# EAGLE design TESTPL (EAGLE 9.4.2)
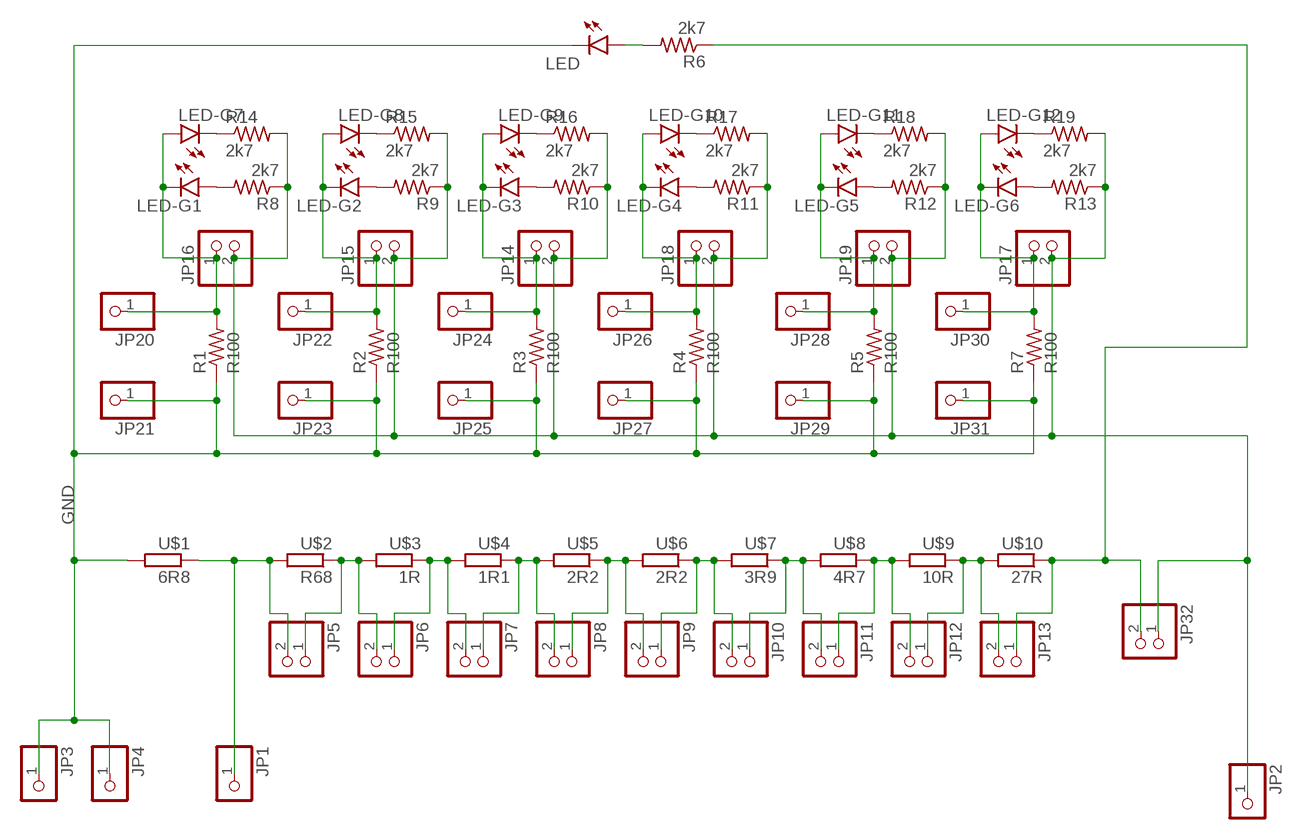
[diagram p0: schematic, sheet 1]

## Parts
JP1  PINHD-1X1  [1X01]
JP2  PINHD-1X1  [1X01]
JP3  PINHD-1X1  [1X01]
JP4  PINHD-1X1  [1X01]
JP5  PINHD-1X2  [1X02]
JP6  PINHD-1X2  [1X02]
JP7  PINHD-1X2  [1X02]
JP8  PINHD-1X2  [1X02]
JP9  PINHD-1X2  [1X02]
JP10  PINHD-1X2  [1X02]
JP11  PINHD-1X2  [1X02]
JP12  PINHD-1X2  [1X02]
JP13  PINHD-1X2  [1X02]
JP14  PINHD-1X2  [1X02]
JP15  PINHD-1X2  [1X02]
JP16  PINHD-1X2  [1X02]
JP17  PINHD-1X2  [1X02]
JP18  PINHD-1X2  [1X02]
JP19  PINHD-1X2  [1X02]
JP20  PINHD-1X1  [1X01]
JP21  PINHD-1X1  [1X01]
JP22  PINHD-1X1  [1X01]
JP23  PINHD-1X1  [1X01]
JP24  PINHD-1X1  [1X01]
JP25  PINHD-1X1  [1X01]
JP26  PINHD-1X1  [1X01]
JP27  PINHD-1X1  [1X01]
JP28  PINHD-1X1  [1X01]
JP29  PINHD-1X1  [1X01]
JP30  PINHD-1X1  [1X01]
JP31  PINHD-1X1  [1X01]
JP32  PINHD-1X2  [1X02]
LED  LEDCHIPLED_0603  [CHIPLED_0603]
LED-G1  LEDCHIPLED_0603  [CHIPLED_0603]
LED-G2  LEDCHIPLED_0603  [CHIPLED_0603]
LED-G3  LEDCHIPLED_0603  [CHIPLED_0603]
LED-G4  LEDCHIPLED_0603  [CHIPLED_0603]
LED-G5  LEDCHIPLED_0603  [CHIPLED_0603]
LED-G6  LEDCHIPLED_0603  [CHIPLED_0603]
LED-G7  LEDCHIPLED_0603  [CHIPLED_0603]
LED-G8  LEDCHIPLED_0603  [CHIPLED_0603]
LED-G9  LEDCHIPLED_0603  [CHIPLED_0603]
LED-G10  LEDCHIPLED_0603  [CHIPLED_0603]
LED-G11  LEDCHIPLED_0603  [CHIPLED_0603]
LED-G12  LEDCHIPLED_0603  [CHIPLED_0603]
R1  R100  R-US_R2512  [R2512]
R2  R100  R-US_R2512  [R2512]
R3  R100  R-US_R2512  [R2512]
R4  R100  R-US_R2512  [R2512]
R5  R100  R-US_R2512  [R2512]
R6  2k7  R-US_R0603  [R0603]
R7  R100  R-US_R2512  [R2512]
R8  2k7  R-US_R0603  [R0603]
R9  2k7  R-US_R0603  [R0603]
R10  2k7  R-US_R0603  [R0603]
R11  2k7  R-US_R0603  [R0603]
R12  2k7  R-US_R0603  [R0603]
R13  2k7  R-US_R0603  [R0603]
R14  2k7  R-US_R0603  [R0603]
R15  2k7  R-US_R0603  [R0603]
R16  2k7  R-US_R0603  [R0603]
R17  2k7  R-US_R0603  [R0603]
R18  2k7  R-US_R0603  [R0603]
R19  2k7  R-US_R0603  [R0603]
U$1  6R8  SQP  [SQP]
U$2  R68  SQP  [SQP]
U$3  1R  SQP  [SQP]
U$4  1R1  SQP  [SQP]
U$5  2R2  SQP  [SQP]
U$6  2R2  SQP  [SQP]
U$7  3R9  SQP  [SQP]
U$8  4R7  SQP  [SQP]
U$9  10R  SQP  [SQP]
U$10  27R  SQP  [SQP]

## Nets
GND: JP3.1 JP4.1 JP21.1 JP23.1 JP25.1 JP27.1 JP29.1 JP31.1 LED.C R1.1 R2.1 R3.1 R4.1 R5.1 R7.1 U$1.P$2
N$1: JP1.1 JP5.2 U$1.P$1 U$2.P$2
N$2: JP5.1 JP6.2 U$2.P$1 U$3.P$2
N$3: JP6.1 JP7.2 U$3.P$1 U$4.P$2
N$4: JP7.1 JP8.2 U$4.P$1 U$5.P$2
N$5: JP8.1 JP9.2 U$5.P$1 U$6.P$2
N$6: JP9.1 JP10.2 U$6.P$1 U$7.P$2
N$7: JP10.1 JP11.2 U$7.P$1 U$8.P$2
N$8: JP11.1 JP12.2 U$8.P$1 U$9.P$2
N$9: JP12.1 JP13.2 U$9.P$1 U$10.P$2
N$10: JP17.1 JP30.1 LED-G6.C LED-G12.A R7.2
N$11: JP2.1 JP14.2 JP15.2 JP16.2 JP17.2 JP18.2 JP19.2 JP32.1 R8.1 R9.1 R10.1 R11.1 R12.1 R13.1 R14.2 R15.2 R16.2 R17.2 R18.2 R19.2
N$12: JP19.1 JP28.1 LED-G5.C LED-G11.A R5.2
N$13: JP18.1 JP26.1 LED-G4.C LED-G10.A R4.2
N$14: JP14.1 JP24.1 LED-G3.C LED-G9.A R3.2
N$15: JP15.1 JP22.1 LED-G2.C LED-G8.A R2.2
N$16: JP16.1 JP20.1 LED-G1.C LED-G7.A R1.2
N$17: JP13.1 JP32.2 R6.1 U$10.P$1
N$18: LED-G1.A R8.2
N$19: LED-G2.A R9.2
N$20: LED-G3.A R10.2
N$21: LED-G4.A R11.2
N$22: LED-G5.A R12.2
N$23: LED-G6.A R13.2
N$24: LED-G8.C R15.1
N$25: LED-G7.C R14.1
N$26: LED-G9.C R16.1
N$27: LED-G10.C R17.1
N$28: LED-G11.C R18.1
N$29: LED-G12.C R19.1
N$38: LED.A R6.2

## Library data of the parts
JP1-JP4 JP20-JP31 = pinheadCS:PINHD-1X1: PIN HEADER
JP5-JP19 JP32 = pinheadCS:PINHD-1X2: PIN HEADER
LED LED-G1-LED-G12 = led:LED: LED OSRAM: - CHIPLED LG R971, LG N971, LY N971, LG Q971, LY Q971, LO R971, LY R971 LH N974, LH R974 LS Q976, LO Q976, LY Q976 LO Q996 - Hyper CHIPLED LW Q18S LB Q993, LB Q99A, LB R99A - SideLED LS A670, LO A670, LY A670, LG A670, LP A670 LB A673, LV A673, LT A673, LW A673 LH A674 LY A675 LS A676, LA A676, LO A676, LY A676, LW A676 LS A679, LY A679, LG A679 - Hyper Micro SIDELED® LS Y876, LA Y876, LO Y876, LY Y876 LT Y87S - SmartLED LW L88C, LW L88S LB L89C, LB L89S, LG L890 LS L89K, LO L89K, LY L89K LS L896, LA L896, LO L896, LY L896 - TOPLED LS T670, LO T670, LY T670, LG T670, LP T670 LSG T670, LSP T670, LSY T670, LOP T670, LYG T670 LG T671, LOG T671, LSG T671 LB T673, LV T673, LT T673, LW T673 LH T674 LS T676, LA T676, LO T676, LY T676, LB T676, LH T676, LSB T676, LW T676 LB T67C, LV T67C, LT T67C, LS T67K, LO T67K, LY T67K, LW E67C LS E67B, LA E67B, LO E67B, LY E67B, LB E67C, LV E67C, LT E67C LW T67C LS T679, LY T679, LG T679 LS T770, LO T770, LY T770, LG T770, LP T770 LB T773, LV T773, LT T773, LW T773 LH T774 LS E675, LA E675, LY E675, LS T675 LS T776, LA T776, LO T776, LY T776, LB T776 LHGB T686 LT T68C, LB T68C - Hyper Mini TOPLED® LB M676 - Mini TOPLED Santana® LG M470 LS M47K, LO M47K, LY M47K Source: http://www.osram.convergy.de LUXEON: - LUMILED® LXK2-PW12-R00, LXK2-PW12-S00, LXK2-PW14-U00, LXK2-PW14-V00 LXK2-PM12-R00, LXK2-PM12-S00, LXK2-PM14-U00 LXK2-PE12-Q00, LXK2-PE12-R00, LXK2-PE12-S00, LXK2-PE14-T00, LXK2-PE14-U00 LXK2-PB12-K00, LXK2-PB12-L00, LXK2-PB12-M00, LXK2-PB14-N00, LXK2-PB14-P00, LXK2-PB14-Q00 LXK2-PR12-L00, LXK2-PR12-M00, LXK2-PR14-Q00, LXK2-PR14-R00 LXK2-PD12-Q00, LXK2-PD12-R00, LXK2-PD12-S00 LXK2-PH12-R00, LXK2-PH12-S00 LXK2-PL12-P00, LXK2-PL12-Q00, LXK2-PL12-R00 Source: www.luxeon.com KINGBRIGHT: KA-3528ASYC Source: www.kingbright.com
R1-R5 R7 = rcl:R-US_: RESISTOR, American symbol; SPICEPREFIX: R
R6 R8-R19 = resistor:R-US_: RESISTOR, American symbol
U$1-U$10 = CanCubeSat:SQP

## Board
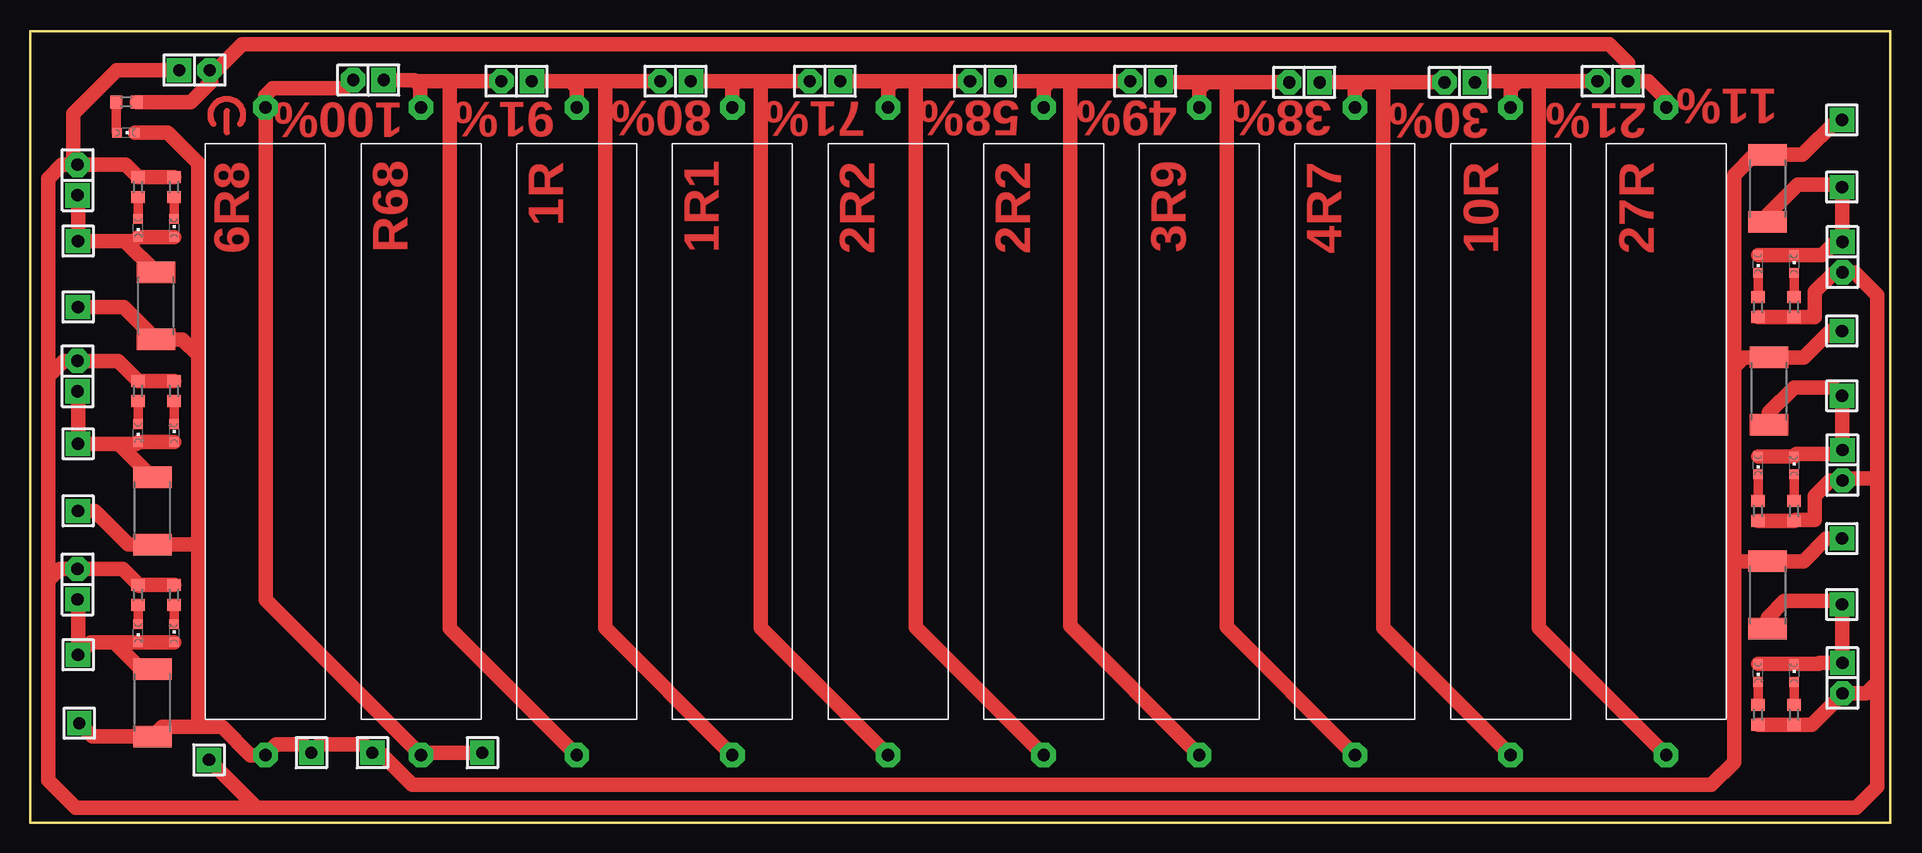
[diagram p1: board, top side]

Size 155 x 66 mm. Coordinates in mm from the lower left corner, seen from the top.
Outline: 0,0 155,0 155,66 0,66 0,0
Copper layers (1*16): Top 0.035mm / dielectric 1.5mm / Bottom 0.035mm
Design rules "default *": minimum track width 0.3mm, minimum drill 0.35mm, track to track 0.5mm, track to pad 0.5mm, pad to pad 0.5mm, via to via 0.5mm, smd to smd 0.2mm, copper to edge 0.35mm, drill to drill 6mil, minimum pad ring 20mil, minimum via ring 8mil, stop-mask expansion 4mil, vias tented up to drill 0mil, thermal gap 10mil

### Footprints (pad centres in the part's own frame; a part is rotated, then mirrored left to right if it is on the bottom)
1X01 = drill 1.016 square: 1 0,0
1X02 = drill 1.016 square: 1 -1.27,0 | drill 1.016 octagon: 2 1.27,0
CHIPLED_0603 = smd 0.8 x 0.8: A 0,-0.75; C 0,0.75
R2512 = smd 1.8 x 3.2: 1 -2.8,0; 2 2.8,0
R0603 = smd 1 x 1.1: 1 -0.85,0; 2 0.85,0
SQP = drill 1.02 octagon: P$1 -27,0; P$2 27,0

### Placement (x,y rotation side)
JP1  37.69,5.84 0 top
JP2  14.91,5.24 0 top
JP3  28.53,5.84 0 top
JP4  23.45,5.84 0 top
JP5  28.2,61.93 180 top
JP6  40.55,61.83 180 top
JP7  53.8,61.83 180 top
JP8  66.25,61.83 180 top
JP9  79.6,61.83 180 top
JP10  92.95,61.83 180 top
JP11  106.2,61.73 180 top
JP12  119.15,61.73 180 top
JP13  131.9,61.83 180 top
JP14  3.96,53.59 90 top
JP15  3.96,37.24 90 top
JP16  3.96,19.89 90 top
JP17  151.04,12.06 270 top
JP18  151.04,29.81 270 top
JP19  151.04,47.16 270 top
JP20  4,14 0 top
JP21  4.1,8.3 0 top
JP22  4,31.6 0 top
JP23  4,26 0 top
JP24  4,48.5 0 top
JP25  4,43 0 top
JP26  151,35.6 180 top
JP27  151,41 180 top
JP28  151,53 180 top
JP29  151,58.6 180 top
JP30  151,18.2 180 top
JP31  151,23.7 180 top
JP32  13.7,62.75 0 top
LED  7.99,57.53 270 top
LED-G1  9,15.8 180 top
LED-G2  9,32.5 180 top
LED-G3  9,49.6 180 top
LED-G4  147,29.8 0 top
LED-G5  147,46.6 0 top
LED-G6  147,12.5 0 top
LED-G7  12,15.8 0 top
LED-G8  12,32.5 0 top
LED-G9  12,49.6 0 top
LED-G10  144,29.8 180 top
LED-G11  144,46.6 180 top
LED-G12  144,12.5 180 top
R1  10.2,10 90 top
R2  10.2,26 90 top
R3  10.5,43.1 90 top
R4  144.9,36 270 top
R5  144.8,52.9 270 top
R6  8.03,60.09 180 top
R7  144.8,19 270 top
R8  9,19 270 top
R9  9,36 270 top
R10  9,53 270 top
R11  147,26 90 top
R12  147,43 90 top
R13  147,9 90 top
R14  12,19 90 top
R15  12,36 90 top
R16  12,53 90 top
R17  144,26 270 top
R18  144,43 270 top
R19  144,9 270 top
U$1  19.62,32.64 270 top
U$2  32.59,32.64 270 top
U$3  45.56,32.64 270 top
U$4  58.53,32.64 270 top
U$5  71.5,32.64 270 top
U$6  84.47,32.64 270 top
U$7  97.44,32.64 270 top
U$8  110.41,32.64 270 top
U$9  123.38,32.64 270 top
U$10  136.35,32.64 270 top

### Tracks (layer width: path | path; a pad name or v marks a point on that pad's centre or on a via)
GND
  Top 1.2: 14,8 16,8 18.36,5.64 U$1.P$2 20.52,6.54 22.75,6.54 JP4.1 24.15,6.54 27.83,6.54 JP3.1 29.18,5.84 31.87,3.15 140.1,3.15 142,5.05 142,22 | 14,8 14,23.2 | 14,39 12.7,40.3 R3.1 7.8,43 JP25.1 | 14,23.2 R2.1 8.2,23.2 5.4,26 JP23.1 | 14,8 11,8 R1.1 5.2,7.2 JP21.1 | 142,38 142,22 | 142,38 142,54 143.7,55.7 R5.1 147.7,55.7 150.6,58.6 JP29.1 | JP27.1 150,41 147.8,38.8 R4.1 142.8,38.8 142,38 | JP31.1 149.7,23.7 147.8,21.8 R7.1 142.2,21.8 142,22 | 14,23.2 14,39 | 14,39 14,55 11.47,57.53 LED.C
N$1
  Top 1.2: JP1.1 32.79,5.84 U$2.P$2 19.65,18.58 19.65,59.61 U$1.P$1 19.62,60.64 20.22,61.24 26.24,61.24 JP5.2
N$2
  Top 1.2: U$3.P$2 34.98,16.22 34.98,61.83 JP6.2 32.1,61.83 | U$2.P$1 32.5,59.73 32.5,61.43 32.1,61.83 | JP5.1 32,61.93 32.1,61.83
N$3
  Top 1.2: U$4.P$2 47.93,16.24 47.93,61.83 JP7.2 45,61.83 | 45,61.83 JP6.1 | U$3.P$1 45.56,61.27 45,61.83
N$4
  Top 1.2: U$5.P$2 60.88,16.26 60.88,61.83 JP8.2 59,61.83 | 59,61.83 JP7.1 | U$4.P$1 58.53,61.36 59,61.83
N$5
  Top 1.2: U$6.P$2 73.83,16.28 73.83,61.83 JP9.2 72,61.83 | 72,61.83 JP8.1 | U$5.P$1 71.5,61.33 72,61.83
N$6
  Top 1.2: U$7.P$2 86.68,16.4 86.68,61.83 JP10.2 85,61.83 | 85,61.83 JP9.1 | U$6.P$1 84.47,61.3 85,61.83
N$7
  Top 1.2: U$8.P$2 99.73,16.32 99.73,61.73 JP11.2 98,61.73 | 98,61.73 94.32,61.73 JP10.1 | U$7.P$1 97.44,61.17 98,61.73
N$8
  Top 1.2: U$9.P$2 112.78,16.24 112.78,61.73 JP12.2 111,61.73 | 111,61.73 JP11.1 | U$8.P$1 110.41,61.14 111,61.73
N$9
  Top 1.2: U$10.P$2 125.73,16.26 125.73,61.83 JP13.2 124,61.83 | 124,61.83 120.52,61.83 JP12.1 | U$9.P$1 123.38,61.21 124,61.83
N$10
  Top 1.2: JP30.1 151.04,18.16 | 151.04,18.16 151.04,18.5 146.2,18.5 144.8,17.1 R7.2 | 151.04,18.16 JP17.1 149.14,13.33 149.06,13.25 LED-G6.C LED-G12.A
N$11
  Top 1.2: 1.5,37.2 1.5,53.7 2.66,54.86 3.6,54.86 | 1.5,37.2 1.5,20.2 | 3.6,54.86 JP14.2 7.99,54.86 R10.1 R16.2 | 1.5,37.2 2.81,38.51 JP15.2 7.34,38.51 R9.1 R15.2 | 1.5,20.2 2.46,21.16 JP16.2 7.74,21.16 9.15,19.75 9.1,19.75 R8.1 R14.2 | R18.2 R12.1 148.74,42.15 148.74,44.29 150.34,45.89 JP19.2 152.06,45.89 153.95,44 153.95,28.7 | R17.2 R11.1 147.1,25.25 148.74,25.25 148.74,27.24 150.04,28.54 JP18.2 151.2,28.7 153.95,28.7 | R19.2 R13.1 148.48,8.15 151.04,10.71 JP17.2 153.04,10.79 153.95,11.7 | 153.95,11.7 153.95,3 152.2,1.25 18.9,1.25 | 18.9,1.25 JP2.1 | 1.5,20.2 1.5,3.55 3.8,1.25 18.9,1.25 | 153.95,11.7 153.95,28.7 | 3.6,54.86 3.6,59.12 7.23,62.75 JP32.1
N$12
  Top 1.2: LED-G11.A LED-G5.C 149.36,47.35 150.44,48.43 JP19.1 151,48.47 JP28.1 150.8,53.2 147.3,53.2 144.8,50.7 R5.2
N$13
  Top 1.2: LED-G10.A LED-G4.C 147.2,30.75 150.71,30.75 JP18.1 151,31.12 JP26.1 150.3,36.3 147,36.3 144.9,34.2 R4.2
N$14
  Top 1.2: LED-G9.A LED-G3.C 8.65,48.5 7.9,48.5 | JP14.1 4,52.28 JP24.1 7.9,48.5 | 7.9,48.5 R3.2
N$15
  Top 1.2: JP15.1 4,35.93 JP22.1 7,31.6 7.4,31.6 | LED-G8.A LED-G2.C 8.85,31.6 7.4,31.6 | 7.4,31.6 R2.2
N$16
  Top 1.2: JP16.1 4,18.58 JP20.1 5.05,15.05 7,15.05 | LED-G7.A LED-G1.C 7,15.05 | 7,15.05 9.25,12.8 R1.2
N$17
  Top 1.2: U$10.P$1 136.35,60.34 134.86,61.83 JP13.1 133.17,63.33 131.6,64.9 17.67,64.9 15.52,62.75 JP32.2 15.12,62.6 15.12,61.8 13.41,60.09 R6.1
N$18
  Top 0.8: LED-G1.A R8.2
N$19
  Top 0.8: R9.2 LED-G2.A
N$20
  Top 0.8: LED-G3.A R10.2
N$21
  Top 0.8: LED-G4.A R11.2
N$22
  Top 0.8: R12.2 LED-G5.A
N$23
  Top 0.8: LED-G6.A R13.2
N$24
  Top 0.8: LED-G8.C R15.1
N$25
  Top 0.8: LED-G7.C R14.1
N$26
  Top 0.8: LED-G9.C R16.1
N$27
  Top 0.8: LED-G10.C R17.1
N$28
  Top 0.8: R18.1 LED-G11.C
N$29
  Top 0.8: LED-G12.C R19.1
N$30
  Top 0.5: 16.4,57.55 16.4,59.35
N$31
  Top 0.5: 15.3,58.25 arc-250 17.5,58.25
N$38
  Top 0.8: LED.A 7.18,57.59 R6.2

### Text on the board
Top: 11% | 100% | 91% | 80% | 71% | 58% | 49% | 38% | 30% | 21%